# EasyEDA Pro project si4732_放大器3选1版_2869_427_420.epro

# Schematic schematic1_2
Create Date: 2024-05-16; Page Name: P1; Project Name: si4732 1.4.4 2869 427 420; Schematic Name: schematic1_2; Update Date: 2024-05-16; Company: 嘉立创EDA; Page Size: A4; Version: V1.0
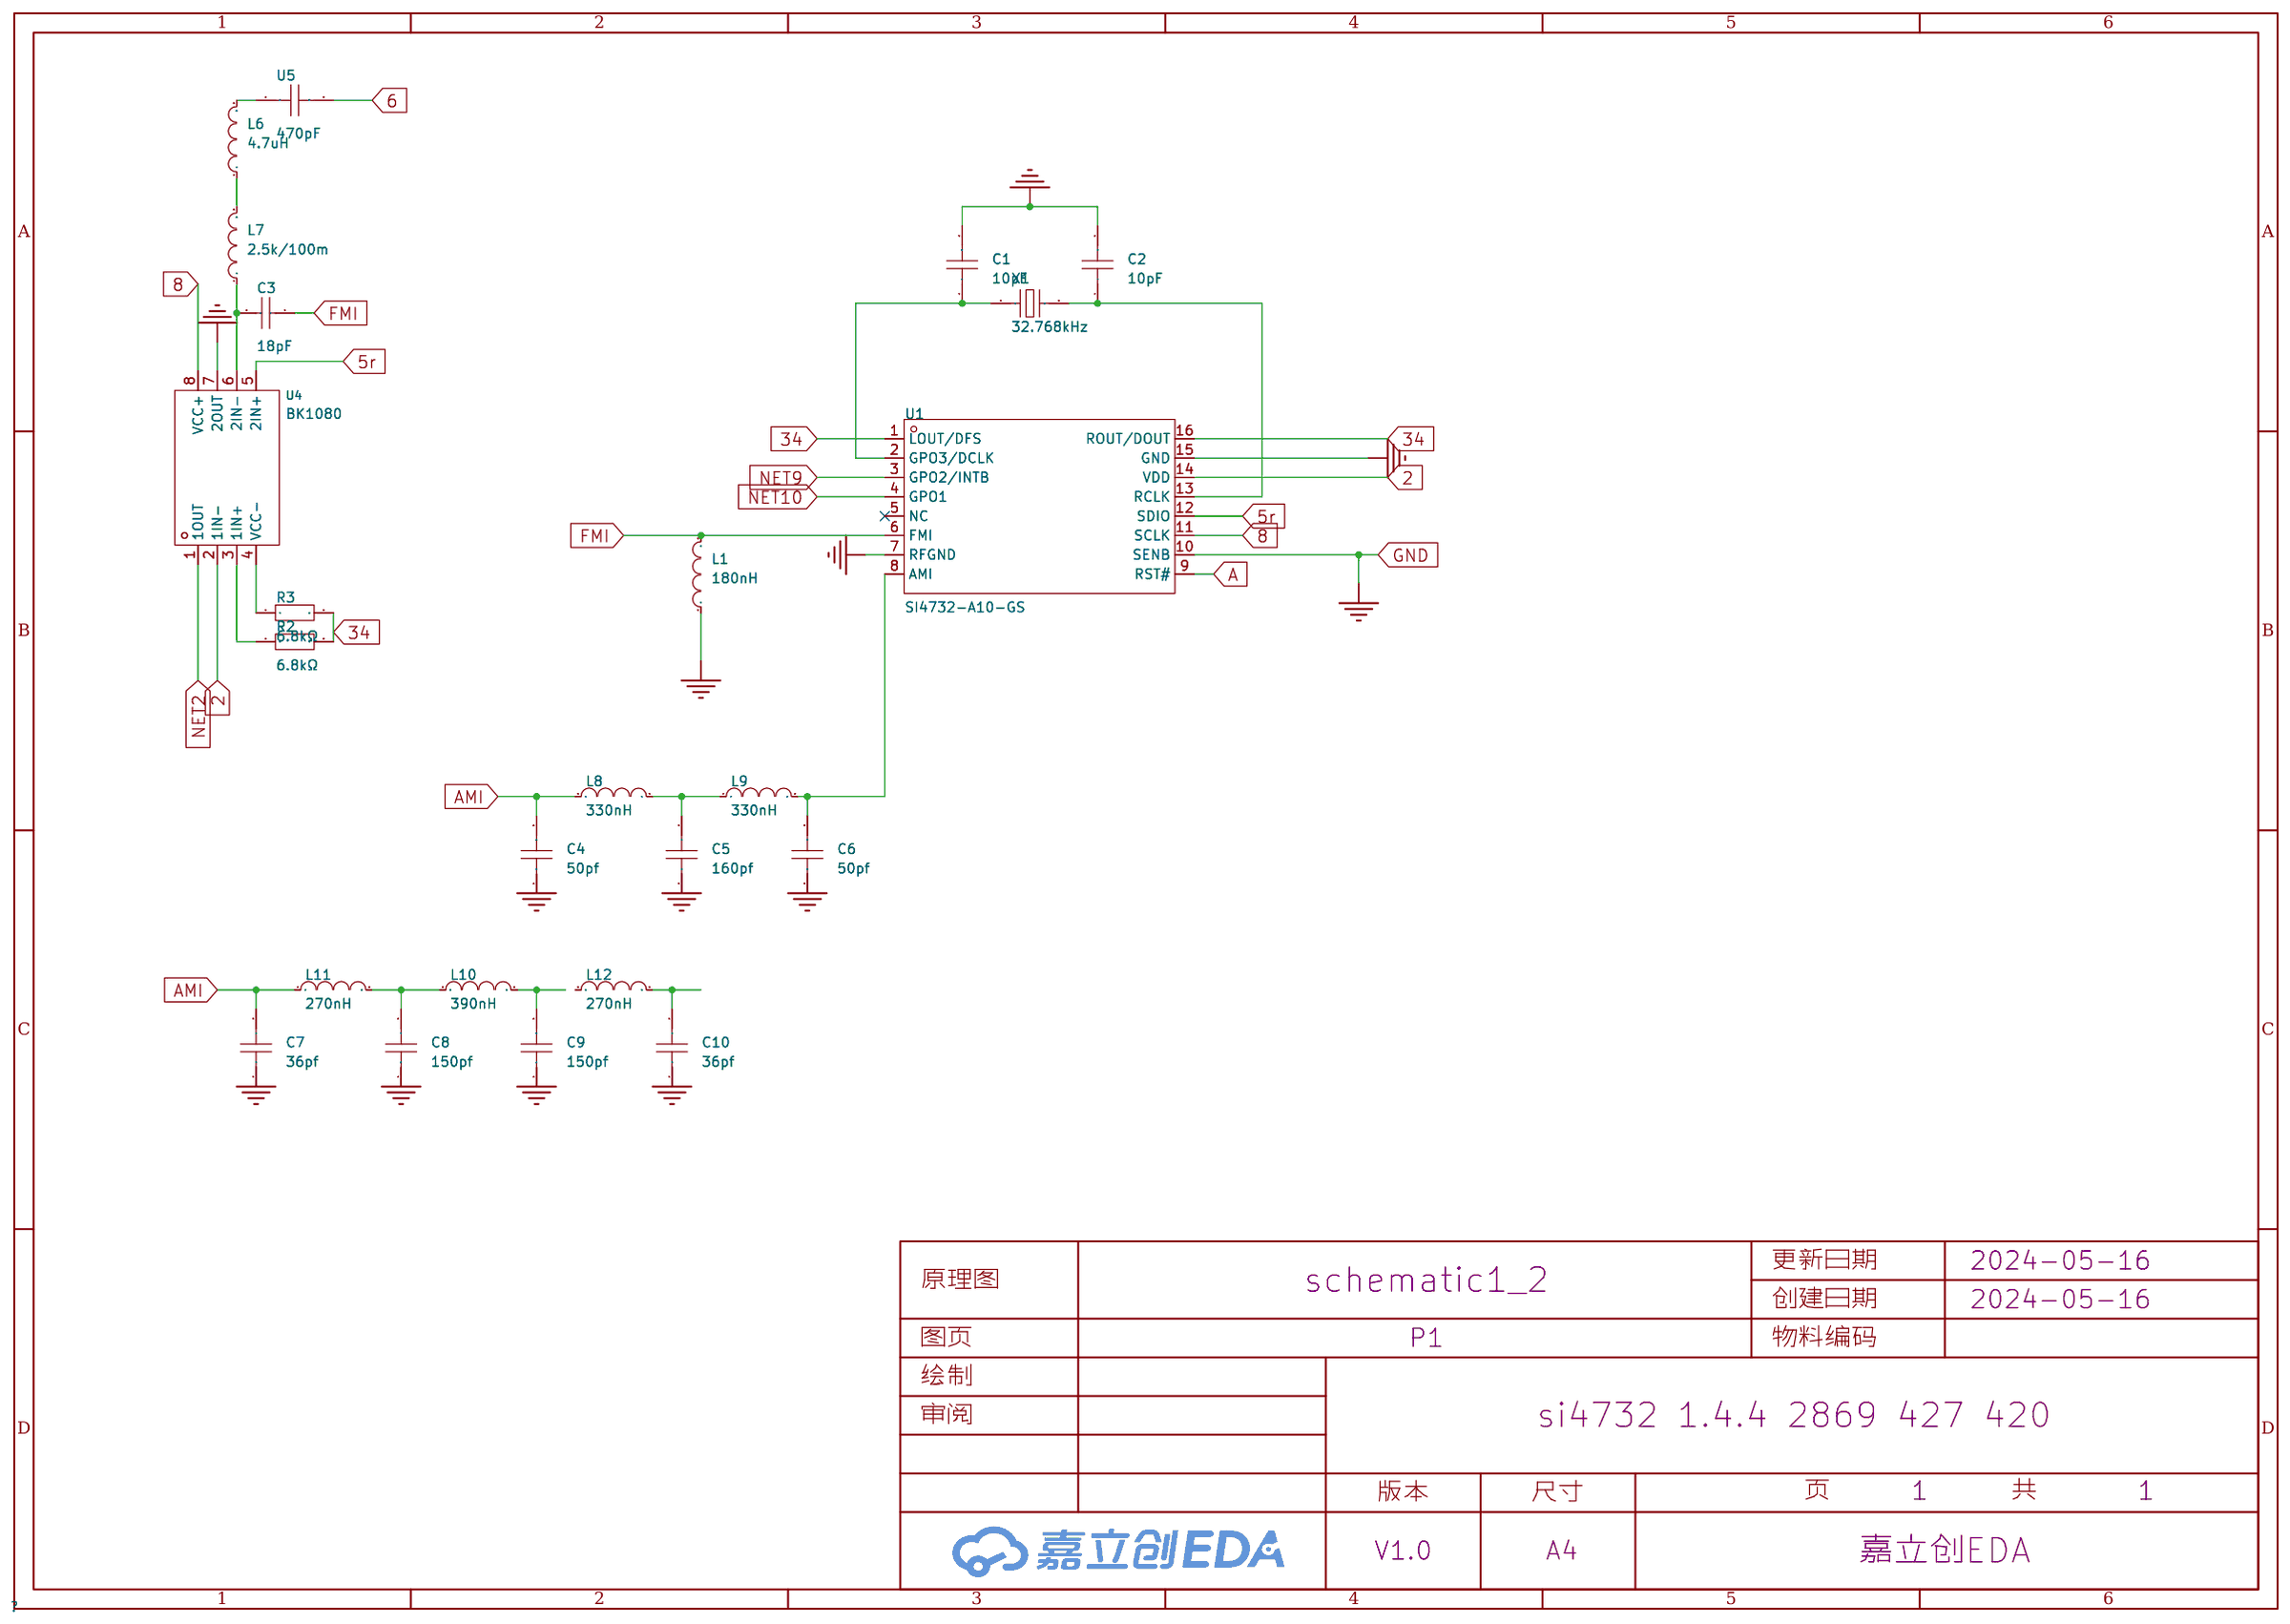
[diagram p0: schematic sheet]

## Parts
C1  10pF  [C0402]
C2  10pF  [C0402]
C3  18pF  [C0402]
C4  50pf  [C0603]
C5  160pf  [C0603]
C6  50pf  [C0603]
C7  36pf  [C0603]
C8  150pf  [C0603]
C9  150pf  [C0603]
C10  36pf  [C0603]
L1  180nH  [L0402]
L6  4.7uH  [L0805]
L7  2.5k/100m  [L0603]
L8  330nH  [L0603]
L9  330nH  [L0603]
L10  390nH  [L0603]
L11  270nH  [L0603]
L12  270nH  [L0603]
R2  6.8kΩ  [R0402]
R3  6.8kΩ  [R0402]
U1  SI4732-A10-GS  [SOIC-16_L9.9-W3.9-P1.27-LS6.0-BL]
U4  BK1080  [SOIC-8_L5.0-W4.0-P1.27-LS6.0-BL]
U5  470pF  [C0402]
X1  32.768kHz  [OSC-SMD_L3.2-W1.5]

## Library data of the parts
C1 C2 = CL05C100JB5NNNC: 容值:10pF;精度:±5%;额定电压:50V;材质(温度系数):C0G;; LCSC Part Name: 10pF ±5% 50V; Supplier Part: C32949; Manufacturer: SAMSUNG(三星); Supplier Footprint: 0402; JLCPCB Part Class: 基础库; Datasheet: https://atta.szlcsc.com/upload/public/pdf/source/20160218/1457707763339.pdf; Supplier: LCSC; Tolerance: ±5%; Voltage Rated: 50V; Temperature Coefficient: C0G
C3 = 0402CG180J500NT: 容值:18pF;精度:±5%;额定电压:50V;材质(温度系数):C0G;; LCSC Part Name: 18pF ±5% 50V; Supplier Part: C1549; Manufacturer: FH(风华); Supplier Footprint: 0402; JLCPCB Part Class: 基础库; Datasheet: https://atta.szlcsc.com/upload/public/pdf/source/20200305/C486355_26A10D38EF8C2A5C37091D0039909270.pdf; Supplier: LCSC; Tolerance: ±5%; Voltage Rated: 50V; Temperature Coefficient: C0G
C4-C10 = CAP_0603: Supplier Footprint: 0603
L1 = SDWL1005CHR18JSTF: 电感值:180nH;精度:±5%;额定电流:240mA;饱和电流(Isat):-;直流电阻(DCR):2.5Ω;; LCSC Part Name: 180nH ±5% 停产; Supplier Part: C431686; Manufacturer: Sunlord(顺络); Supplier Footprint: 0402; JLCPCB Part Class: 扩展库; Datasheet: https://atta.szlcsc.com/upload/public/pdf/source/20190926/C431686_AEDC078FFCD629BE6EEB5C183034C1A3.pdf; Supplier: LCSC; Tolerance: ±5%; Rated Current: 240mA; DC Resistance (DCR): 2.5Ω
L6 = CMP201209UD4R7KT: 电感值:4.7uH;精度:±10%;额定电流:-;饱和电流(Isat):-;直流电阻(DCR):-;; LCSC Part Name: 4.7uH ±10%; Supplier Part: C395016; Manufacturer: FH(风华); Supplier Footprint: 0805; JLCPCB Part Class: Extended Part; Datasheet: https://atta.szlcsc.com/upload/public/pdf/source/20190725/C395026_BA90C77C1AF2738C4273821E5EB03A67.pdf; Supplier: LCSC; Tolerance: ±10%; Type: 叠层电感
L7-L12 = L_0603
R2 R3 = RK73B1ETTP682J: 电阻类型:厚膜电阻;阻值:6.8kΩ;精度:±5%;功率:100mW;最大工作电压:50V;温度系数:±200ppm/℃;; LCSC Part Name: 厚膜电阻 6.8kΩ ±5% 100mW; Supplier Part: C131617; Manufacturer: KOA; Supplier Footprint: 0402; JLCPCB Part Class: 扩展库; Datasheet: https://atta.szlcsc.com/upload/public/pdf/source/20181025/C276126_7835D6FFE428BCC4E2CCD47362622A8E.pdf; Supplier: LCSC; Type: 厚膜电阻; Tolerance: ±5%; Power(Watts): 100mW; Overload Voltage (Max): 50V; Temperature Coefficient: ±200ppm/℃; Operating Temperature Range: -55℃~+155℃
U1 = SI4732-A10-GS: Supplier Part: C1526102; Manufacturer: SKYWORKS/SILICON LABS(芯科); Supplier Footprint: SOIC-16; JLCPCB Part Class: 扩展库; Datasheet: https://atta.szlcsc.com/upload/public/pdf/source/20210612/48A862A402F2CEF593B5DD010C205F92.pdf; Supplier: LCSC
U4 = TL072CDT: 放大器数:双路;增益带宽积(GBP):4MHz;输入偏置电流(Ib):20pA;输入失调电压(Vos):3mV;压摆率(SR):16V/us;轨到轨:-;; Supplier Part: C6961; Manufacturer: ST(意法半导体); Supplier Footprint: SOIC-8; JLCPCB Part Class: 基础库; Datasheet: https://atta.szlcsc.com/upload/public/pdf/source/20140724/1457707166306.pdf; Supplier: LCSC; Number of Circuits: 双路; Gain Bandwidth Product(GBP): 4MHz; Current - Input Bias(Ib): 20pA; Voltage - Input Offset(Vos): 3mV; Slew Rate(SR): 16V/us; Supply Current Per Channel: 2.5mA; Operating Temperature: 0℃~+70℃
U5 = C1005CH2A471K050BA: 容值:470pF;精度:±10%;额定电压:100V;材质(温度系数):CH;; LCSC Part Name: 470pF ±10% 100V; Supplier Part: C3849341; Manufacturer: TDK; Supplier Footprint: 0402; Datasheet: https://atta.szlcsc.com/upload/public/pdf/source/231023/files-179e77ec57705f1f6a0fa868e4e425d4.pdf; Supplier: LCSC; Tolerance: ±10%; Voltage Rated: 100V; Temperature Coefficient: CH
X1 = X321532768KGD2SI: 晶振类型:贴片晶振;频率:32.768kHz;常温频差:±20ppm;外接负载电容:12.5pF;; LCSC Part Name: 32.768kHz ±20ppm 12.5pF; Supplier Part: C620155; Manufacturer: YXC(扬兴晶振); Supplier Footprint: SMD3215-2P; JLCPCB Part Class: 扩展库; Datasheet: https://atta.szlcsc.com/upload/public/pdf/source/20210329/C620155_E5A74FC0D27C5E9015A8D75DE9484FEA.pdf; Supplier: LCSC; Crystal Type: 贴片晶振; Normal temperature Frequency Tolerance: ±20ppm; External load capacitor: 12.5pF; Operating Temperature: -40℃~+85℃

## Nets
GND: C1.2 C2.2 C4.1 C5.1 C6.1 C7.1 C8.1 C9.1 C10.1 L1.1 U1.7(RFGND) U1.10(SENB) U1.15(GND) U4.7(2OUT)
2: U1.14(VDD) U4.2(1IN-)
5r: U1.12(SDIO) U4.5(2IN+)
6: U5.2
8: U1.11(SCLK) U4.8(VCC+)
34: R2.2 R3.2 U1.1(LOUT/DFS) U1.16(ROUT/DOUT)
A: U1.9(RST#)
AMI: C4.2 C7.2 L8.1 L11.1
FMI: C3.1 L1.2 U1.6(FMI)
NET2: U4.1(1OUT)
NET9: U1.3(GPO2/INTB)
NET10: U1.4(GPO1)
Net-(C1-1): C1.1 U1.2(GPO3/DCLK) X1.1
Net-(C2-1): C2.1 U1.13(RCLK) X1.2
Net-(C3-2): C3.2 L7.1 U4.6(2IN-)
Net-(C5-2): C5.2 L8.2 L9.1
Net-(C6-2): C6.2 L9.2 U1.8(AMI)
Net-(C8-2): C8.2 L10.1 L11.2
Net-(C9-2): C9.2 L10.2
Net-(C10-2): C10.2 L12.2
Net-(L6-1): L6.1 L7.2
Net-(L6-2): L6.2 U5.1
Net-(R2-1): R2.1 U4.3(1IN+)
Net-(R3-1): R3.1 U4.4(VCC-)

Not connected (* = marked no-connect by the designer): L12 1; U1 5(NC)*

# Board PCB1_2
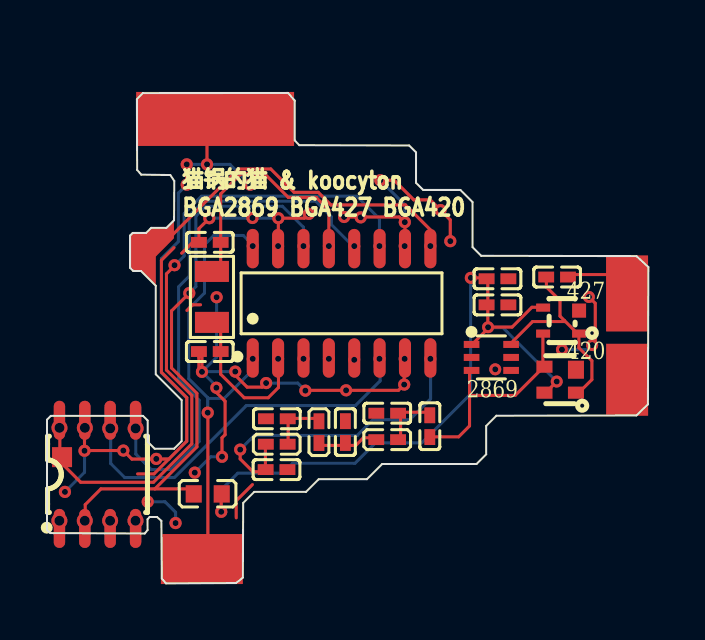
[diagram p1: board, top side]
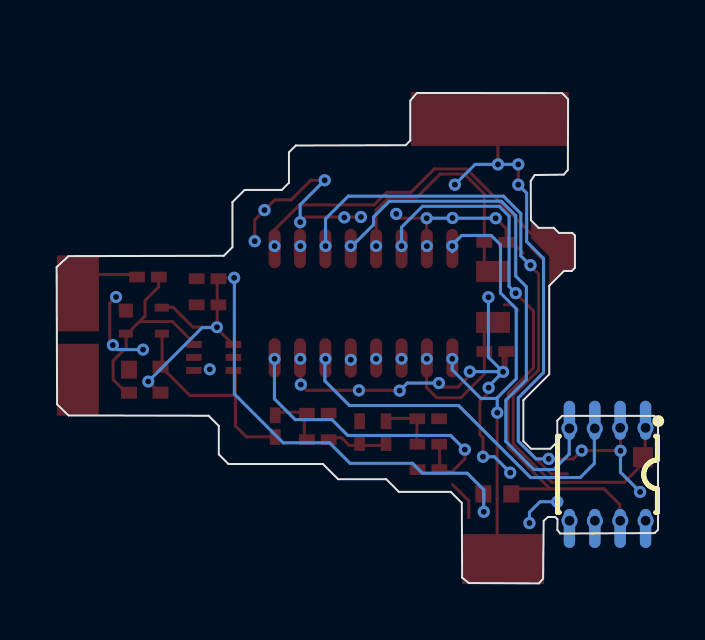
[diagram p2: board, bottom side, seen from below]

Outline 30.1 x 24.53 mm; copper layers: Top Layer, Bottom Layer. Coordinates in mm from the lower left corner of the outline.
Outline path: 0,8.19 0.19,8.38 4.81,8.38 5.04,8.15 5.04,7.09 5.39,6.74 6.36,6.74 6.74,7.12 6.74,9.17 5.44,10.46 5.44,14.89 4.71,15.63 4.32,15.63 4.16,15.79 4.16,17.4 4.29,17.53 4.96,17.53 5.22,17.79 5.98,17.79 6.36,18.17 6.37,20.13 6.17,20.43 4.71,20.45 4.51,20.69 4.5,24.22 4.8,24.53 12.06,24.53 12.4,24.15 12.4,22.16 12.62,21.92 18.12,21.91 18.47,21.56 18.47,20.04 18.82,19.68 20.69,19.68 21.3,19.07 21.3,16.82 21.73,16.39 29.5,16.37 30.1,15.82 30.07,8.96 29.5,8.4 22.49,8.39 21.98,7.88 21.98,6.46 21.5,5.97 16.77,5.97 16.01,5.21 13.6,5.21 12.96,4.58 10.37,4.58 9.82,4.03 9.8,0.29 9.46,0.02 5.95,0 5.75,0.25 5.72,3.13 5.51,3.32 5.14,3.32 5.03,3.21 5.03,2.67 4.89,2.5 0.17,2.52 0,2.69 0,8.19
Stack: Top Layer 0.035mm - / Dielectric1 0.71mm FR4 er 4.5 / Bottom Layer 0.035mm -

## Design rules (mm)
template: 自定义配置
spacing copperThickness1oz (default): track to track 0.102, other pairs 0.1 to 0.3
spacing copperThickness2oz: track to track 0.203, other pairs 0.152 to 0.3
track width copperThickness1oz (default): min 0.127, default 0.254, max 2.54
track width copperThickness2oz: min 0.203, default 0.254, max 2.54
differential pair differentialPair (default): width min 0.127, default 0.254, max 2.54; gap min 0.152, default 0.152
via viaSize (default): diameter min 0.5, default 0.61, max 10; hole min 0.3, default 0.305, max 6.3

## Placement (name value [footprint] x y rotation side)
77  TL072CDT  [SOIC-8_L5.0-W4.0-P1.27-LS6.0-BL]  2.53 5.45 0 bottom
?  TL072CDT  [SOIC-8_L5.0-W4.0-P1.27-LS6.0-BL]  2.53 5.46 0 top
C1  -  [C0402]  17.03 8.51 180 top
C1#2  -  [C0402]  11.49 5.69 180 top
C1#3  -  [C0402]  11.5 8.24 180 top
C1#4  -  [C0402]  22.54 13.93 0 top
C1#5  -  [C0402]  22.54 15.24 0 top
C1#6  -  [C0402]  19.16 7.86 270 top
C1#7  -  [C0402]  25.53 15.33 180 top
C1#8  -  [C0402]  8.15 11.6 180 top
C1#9  -  [C0402]  14.93 7.57 90 top
C2  10pF  [C0402]  8.15 17.06 180 top
NOREF  -  [Pad_e56]  8.41 23.23 0 top
NOREF#2  -  [Pad_e1272]  29.03 14.51 0 top
NOREF#3  -  [Pad_e230]  4.88 16.52 0 top
NOREF#4  -  [Pad_e278]  0.75 6.32 0 top
NOREF#5  -  [Pad_e14]  7.75 1.22 0 top
NOREF#6  -  [Pad_e1273]  29.03 10.19 0 top
U1  SI4732-A10-GS  [SOIC-16_L9.9-W3.9-P1.27-LS6.0-BL]  14.74 14.01 0 top
U3  -  [L0402]  13.61 7.57 90 top
U3#2  -  [L0402]  11.5 6.96 0 top
U3#3  -  [L0402]  17.02 7.19 0 top
U4  -  [SOT-363_L2.0-W1.3-P0.65-LS2.1-BL]  22.24 11.3 270 top
U4#2  -  [L0603]  8.04 4.48 0 top
U5  BGA427H6327XTSA1  [SOT-343-4_L2.0-W1.3-P1.30-LS2.1-BR]  25.73 13.15 0 top
U6  BGA420H6327XTSA1  [SOT343_L2.0-W1.3-P1.30-LS2.1-BL]  25.68 10.19 90 top
X1  32.768kHz  [OSC-SMD_L3.2-W1.5]  8.25 14.33 90 top

## Footprints (pads in the part's own frame, mm; a bottom-side part is the same pattern mirrored in y, then rotated)
C0402
  rect 0.79x0.54 smd: 1(-0.545,0) 2(0.545,0)
L0402
  rect 0.79x0.54 smd: 1(-0.545,0) 2(0.545,0)
L0603
  rect 0.8x0.864 smd: 1(-0.7,0) 2(0.7,0)
OSC-SMD_L3.2-W1.5
  rect 1.05x1.7 smd: 1(-1.275,0) 2(1.275,0)
Pad_e14
  rect 4.1x2.5 smd: 17(0,0)
Pad_e56
  rect 7.9x2.7 smd: 17(0,0)
Pad_e230
  custom 2.212x3.297 smd: 19(0,0)
Pad_e278
  rect 1x1 smd: 88(0,0)
Pad_e1272
  rect 2.1x3.8 smd: 17(0,0)
Pad_e1273
  rect 2.1x3.6 smd: 17(0,0)
SOIC-8_L5.0-W4.0-P1.27-LS6.0-BL
  oval 0.569x1.95 smd: 1(-1.905,-2.705) 2(-0.635,-2.705) 3(0.635,-2.705) 4(1.905,-2.705) 5(1.905,2.705) 6(0.635,2.705) 7(-0.635,2.705) 8(-1.905,2.705)
SOIC-16_L9.9-W3.9-P1.27-LS6.0-BL
  oval 0.602x1.971 smd: 1(-4.445,-2.736) 2(-3.175,-2.736) 3(-1.905,-2.736) 4(-0.635,-2.736) 5(0.635,-2.736) 6(1.905,-2.736) 7(3.175,-2.736) 8(4.445,-2.736) 9(4.445,2.736) 10(3.175,2.736) 11(1.905,2.736) 12(0.635,2.736) 13(-0.635,2.736) 14(-1.905,2.736) 15(-3.175,2.736) 16(-4.445,2.736)
SOT343_L2.0-W1.3-P1.30-LS2.1-BL
  rect 0.6x0.8 smd: 1(-0.65,-0.788) 3(0.65,0.788) 4(-0.65,0.788)
  rect 0.899x0.8 smd: 2(0.5,-0.788)
SOT-343-4_L2.0-W1.3-P1.30-LS2.1-BR
  rect 0.7x0.4 smd: 1(0.9,-0.65) 3(-0.9,0.65) 4(-0.9,-0.65)
  rect 0.7x0.7 smd: 2(0.9,0.5)
SOT-363_L2.0-W1.3-P0.65-LS2.1-BL
  rect 0.35x0.78 smd: 1(-0.65,-0.99) 2(0,-0.99) 3(0.65,-0.99) 4(0.65,0.99) 5(0,0.99) 6(-0.65,0.99)

## Nets
GND: 77.2 ?.7 C1.2 C1#2.1 C1#3.2 C1#4.2 C1#5.2 C1#8.2 C1#9.2 C2.2 NOREF.17 NOREF#6.17 U1.7 U1.10 U1.15 U4.2 U4.4 U4.5 U5.2 U6.2
2: 77.7 ?.2 C1#4.1 C1#5.1 U1.14 U4.1 U4#2.1 U4#2.2 U5.3 U6.4
5R: 77.4 ?.5 U1.12
8: 77.1 ?.8 NOREF#4.88 U1.11
34: NOREF#5.17 U1.1 U1.16
$AMI01: C1.1 C1#3.1 C1#6.1 C1#6.2 C1#9.1 U3.1 U3.2 U3#2.2 U3#3.1 U3#3.2 U4.3 U5.4 U6.3
$AMI_IN2: C1#7.1 C1#7.2 NOREF#2.17 U4.6 U5.1 U6.1
A: NOREF#3.19 U1.9
AMI: C1#2.2 U1.8 U3#2.1
FMI: 77.3 ?.6 U1.6
NET2: 77.8 ?.1
NET9: U1.3
NET10: U1.4
$1N411: 77.6 ?.3
$1N422: 77.5 ?.4
$1N528: C1#8.1 U1.2 X1.1
$1N538: C2.1 U1.13 X1.2

Pads without a net: U1 5

## Via types
v1: diameter 0.6, hole 0.304, Top Layer to Bottom Layer, 22 vias
v2: diameter 0.61, hole 0.304, Top Layer to Bottom Layer, 34 vias
v3: diameter 0.61, hole 0.305, Top Layer to Bottom Layer, 2 vias
v4: diameter 0.8, hole 0.5, Top Layer to Bottom Layer, 8 vias

## Routing (per net, layer and track width the routed paths; a pad name or vN(x,y) marks a point on that pad's centre or on a via; arc(x,y) is an arc through that point)
GND: length 99.6
  Top Layer w0.152: v2(3.82,6.65) 4.25,6.22 6.09,6.22 ; v2(17.91,18.07) 17.91,18.06 17.91,16.89 v1(17.9,16.88) ; v1(11.56,16.88) 11.58,16.89 v2(11.58,18.27) 12.88,18.27 v2(13.1,18.49) ; 7.6,10.71 7.6,11.29 7.75,11.45 v2(7.75,10.58) ; v1(27.28,11.92) 27.44,12.08 27.44,14.01 v1(27.12,14.33) ; 9.47,3.28 9.47,4.13 10.28,4.94 ; 4.53,5.48 5.35,5.48 6.99,7.12 6.99,9.3 5.72,10.57 5.72,16.16 6.36,16.8 ; v2(8.12,18.27) 7.6,17.75 C2.2 7.28,17.06 6.74,16.52
  Top Layer w0.154: v2(20.18,17.12) 20.18,18.18 v2(19.69,18.67) 19.18,19.19 18.35,19.19 17.37,20.17 v2(16.68,20.17) ; 7,13.66 7.29,13.94 7.68,13.94 ; 8.02,23.71 8.01,23.7 v2(8.01,20.96) ; v2(10.97,10.02) 10.76,9.82 10.02,9.82 9.42,10.41 v2(9.42,10.6) ; 17.91,18.05 17.63,18.33 v2(14.87,18.33) ; v4(1.89,7.78) 1.88,7.77 v2(1.88,6.64) 1.89,6.65 v2(3.82,6.65) ; 17.89,11.18 17.88,11.17 v2(17.88,9.95) 17.59,9.66 v2(14.97,9.66) 12.95,9.66 v2(12.93,9.64) ; v2(8.76,6.34) 8.76,7.29 8.91,7.44 8.91,9.11 8.48,9.55 v2(8.48,9.79) ; v2(6.99,20.96) v2(6.99,19.95)
  Bottom Layer w0.152: v2(11.58,18.27) 10.29,18.27 v2(10.28,18.28) 10.27,18.27 v2(8.12,18.27) ; v2(9.42,10.6) 7.77,10.6 ; 7.77,10.6 v2(7.75,10.58) 8.48,9.86 v2(8.48,9.79) ; 7.77,10.6 8.49,11.32 v2(8.49,14.32) ; v2(6.99,20.96) v2(8.01,20.96) 9.15,20.96 v2(10.17,19.95) ; v1(27.28,11.92) 27.05,11.7 v1(25.77,11.7) ; v2(6.99,19.95) 6.57,19.53 6.57,17.1 5.73,16.26 5.73,10.54 6.99,9.28 6.99,7.12 6.1,6.23 v2(5.47,6.23)
  Bottom Layer w0.154: v2(12.93,9.64) 12.55,10.02 v2(10.97,10.02) ; v2(7.4,5.54) 8.19,6.34 v2(8.76,6.34) ; v2(16.68,20.17) 17.91,18.94 v2(17.91,18.07) ; v2(0.9,4.58) 1.88,5.56 v2(1.88,6.64) ; 6.44,3.02 v2(6.43,3.02) 6.43,3.56 5.9,4.09 v2(5.04,4.09)
  vias: v1(17.9,11.24) v1(22.43,10.71) v2(15.7,18.31)
(no net):
  vias: v1(15.38,11.19)
2: length 65.2
  Top Layer w0.152: 7.49,4.73 5.4,4.73 ; 5.4,4.73 2.7,4.73 1.91,3.94 1.91,3.31 1.91,3.31 ; 5.4,4.73 7.5,6.83 7.5,9.51 6.23,10.78 6.23,13.63 v3(7.12,14.52) ; 8.75,4.44 8.89,4.44 8.72,4.27 v2(8.72,3.58) ; v1(25.51,10.1) 24.97,9.56 24.97,9.49 ; v1(22.07,12.82) 22.07,12.76 21.21,11.89 ; 24.92,13.81 24.27,13.81 23.28,12.82 22.06,12.82 22.06,15.29 21.21,15.29 v2(21.21,15.28)
  Bottom Layer w0.152: 12.83,17.35 12.83,16.66 ; 12.83,17.35 12.83,17.82 11.79,18.86 7.94,18.86 7.45,18.37 7.45,14.85 v3(7.12,14.52) ; 12.83,17.35 12.83,17.12 ; v1(25.51,10.1) 22.81,12.79 22.08,12.79 ; 21.21,15.28 21.2,15.27 21.2,9.48 18.75,7.03 16.44,7.03 15.41,6.01 12.29,6.01 11.79,5.51 9.55,5.51 8.72,4.69 v2(8.72,3.58) 8.73,3.57
  vias: v1(12.83,16.88) v4(1.89,3.14)
5R: length 27.5
  Bottom Layer w0.152: 4.44,8.27 4.44,6.47 5.22,5.7 6.21,5.7 7.61,7.1 7.61,9.16 6.59,10.19 6.59,14.84 7.12,15.37 7.12,18.4 7.84,19.12 13.45,19.12 14.23,18.33 14.23,17.95 15.31,16.88 v1(15.38,16.88)
  vias: v4(4.43,7.75)
8: length 33.7
  Top Layer w0.152: 6.38,15.88 5.98,15.48 5.98,10.67 7.25,9.4 7.25,6.98 5.33,5.06 1.68,5.06 0.64,6.1 0.64,7.83 0.63,7.83
  Bottom Layer w0.152: 16.64,17.12 16.64,18.23 15.5,19.37 7.73,19.37 6.87,18.5 6.87,16.38 6.39,15.91
  vias: v1(16.64,16.88) v3(6.38,15.92) v4(0.62,7.78)
34: length 23.5
  Top Layer w0.154: 8.05,8.54 8.05,0.79 7.75,0.49
  Bottom Layer w0.152: 10.29,16.59 10.29,16.93 9.82,17.41 8.35,17.41 7.88,16.94 7.88,14.53 7.09,13.74 7.09,10.23 8.03,9.29 ; 8.04,9.29 8.08,9.25 8.85,9.25 ; 10.3,10.9 10.3,10.69 8.87,9.26 8.86,9.26
  Bottom Layer w0.154: v2(8.04,8.54) 8.04,9.29 ; 8.04,9.29 8.03,9.29
  vias: v1(10.29,16.88) v1(10.3,11.24)
$AMI01: length 20.4
  Top Layer w0.152: 16.35,7.29 15.83,7.29 15.45,6.9 14.93,6.9 ; 14.93,6.9 13.61,6.9 ; 14.93,6.9 14.96,6.94 ; 24.82,12.57 24.82,12.56 24.82,10.8 ; 13.6,8.09 13.43,8.26 12.07,8.26 12.07,6.86 12.05,6.84 ; 21.13,10.67 21.15,10.65 21.15,9.41 ; 21.15,9.41 23.43,9.41 24.93,10.91 ; 21.15,9.41 21.15,7.88 20.6,7.33 19.18,7.33 ; 21.15,9.41 21.14,9.41 ; 17.69,8.56 17.69,7.21 17.71,7.2 ; 17.69,8.56 17.69,8.59 ; 17.69,8.56 19.28,8.56 19.3,8.58 ; 17.69,8.56 17.43,8.56
$AMI_IN2: length 12.7
  Top Layer w0.152: 23.36,11.89 23.33,11.92 23.33,12.13 24.3,13.1 25.9,13.1 25.9,13.14 ; 25.9,13.14 26.53,12.52 ; 25.9,13.14 25.67,13.37 25.67,14.15 24.99,14.83 24.99,15.33 ; 26.62,12.53 26.62,11.79 27.27,11.14 27.27,10.2 26.63,9.55 26.42,9.55 ; 28.38,15.43 28.36,15.45 26.2,15.45 ; 25.92,15.26 25.9,15.24
A: length 18.1
  Top Layer w0.152: 4.73,17 5.84,17 9.58,20.73 11.2,20.73 12.36,19.56 13.57,19.56 14.21,18.93 17.94,18.93 19.19,17.69 19.19,16.86
  vias: v1(19.19,16.88)
AMI: length 15.7
  Top Layer w0.152: v2(9.67,6.69) 9.67,6.23 10.31,5.59 10.91,5.59 10.93,5.61 10.93,6.86
  Bottom Layer w0.154: 19.19,11.11 19.19,11.1 19.19,9.23 18.16,8.19 16.31,8.19 15.53,7.4 10.38,7.4 9.66,6.69 9.65,6.69
  vias: v1(19.19,11.24)
FMI: length 19
  Top Layer w0.152: 16.65,10.71 16.65,10.69 16.64,10.95
  Bottom Layer w0.154: 16.67,11.09 16.67,10.13 15.44,8.9 9.97,8.9 6.37,5.3 3.89,5.3 3.19,6 3.19,7.94
  vias: v1(16.64,11.24) v4(3.16,7.75)
NET2:
  vias: v4(0.62,3.14)
NET9:
  vias: v1(12.84,11.24)
NET10:
  vias: v1(14.11,11.24)
$1N411:
  vias: v4(3.16,3.14)
$1N422:
  vias: v4(4.43,3.14)
$1N528: length 7.5
  Top Layer w0.152: 11.58,10.9 11.58,9.8 11.07,9.29 9.87,9.29 8.69,10.47 C1#8.1 8.69,12.59 8.24,13.04
  vias: v1(11.57,11.24)
$1N538: length 12.9
  Top Layer w0.152: v1(14.1,16.88) 14.1,18.67 13.47,19.31 12.07,19.31 10.9,20.48 9.69,20.48 8.69,19.48 C2.1 8.69,16.05 ; 8.69,16.05 8.24,15.59 ; 8.69,16.05 8.69,15.63

## Copper pours and planes (outline as drawn; the poured copper is in the pictures)
GND on Top Layer: 30.99,16.85 30.94,8.61 29.48,7.1 23.04,6.94 20.4,4.17 11.31,4.1 10.09,2.87 10.1,-0.14 9.76,-0.48 5.75,-0.48 5.46,-0.19 5.46,1.34 4.83,1.97 0.58,1.97 -0.31,2.86 -0.31,8.59 0.23,9.13 4.84,9.13 5.24,8.73 5.24,7.32 5.46,7.09 6.05,7.09 6.56,7.6 6.56,8.76 3.46,11.86 3.45,23.28 0.79,23.2 -0.29,24.27 -0.24,33.18 0.89,34.35 12.07,34.28 13.01,33.29 13.05,22.71 18.62,22.72 22.25,18.77 22.25,17.51 30.28,17.5
GND on Bottom Layer: 30.98,16.82 30.93,8.58 29.47,7.07 23.03,6.9 20.39,4.14 11.3,4.07 10.07,2.84 10.09,-0.21 9.79,-0.51 5.73,-0.51 5.45,-0.22 5.45,1.31 4.82,1.94 0.57,1.94 -0.32,2.82 -0.32,8.55 0.22,9.09 4.83,9.09 5.23,8.7 5.23,7.28 5.45,7.06 6.04,7.06 6.54,7.57 6.54,8.73 3.45,11.82 3.44,23.25 0.78,23.17 -0.3,24.24 -0.26,33.15 0.88,34.32 12.06,34.25 13,33.26 13.03,22.71 18.61,22.68 22.23,18.74 22.23,17.48 30.27,17.47

## Text on the board
Top Silkscreen Layer: 猫锅的猫 & koocyton / BGA2869 BGA427 BGA420 | 2869 | 427 | 420
